# EAGLE schematic Barrel_Jack (EAGLE 7.5.0)
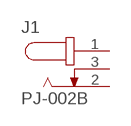
[diagram p0: schematic, sheet 1]

## Parts
J1  PJ-002B  [CUI_PJ-002B]
Unconnected: J1.1 J1.2 J1.3

## Library data of the parts
J1 = PJ-002B:PJ-002B: 2.5 mm Center Pin, 2.5 A, Right Angle, Through Hole, Dc Power Jack Connector Check prices <https://pricing.snapeda.com/parts/PJ-002B/CUI%20Devices/view-part?ref=eda>; AVAILABILITY: Good; CUI_PURCHASE_URL: https://www.cuidevices.com/product/interconnect/connectors/dc-power-connectors/jacks/pj-002b?utm_source=snapeda.com&utm_medium=referral&utm_campaign=snapedaBOM; DESCRIPTION: 2.5 x 6.5 mm, 2.5 A, Horizontal, Through Hole, Dc Power Jack Connector; MF: CUI Devices; MP: PJ-002B; PACKAGE: None; PRICE: None; PURCHASE-URL: https://pricing.snapeda.com/search/part/PJ-002B/?ref=eda